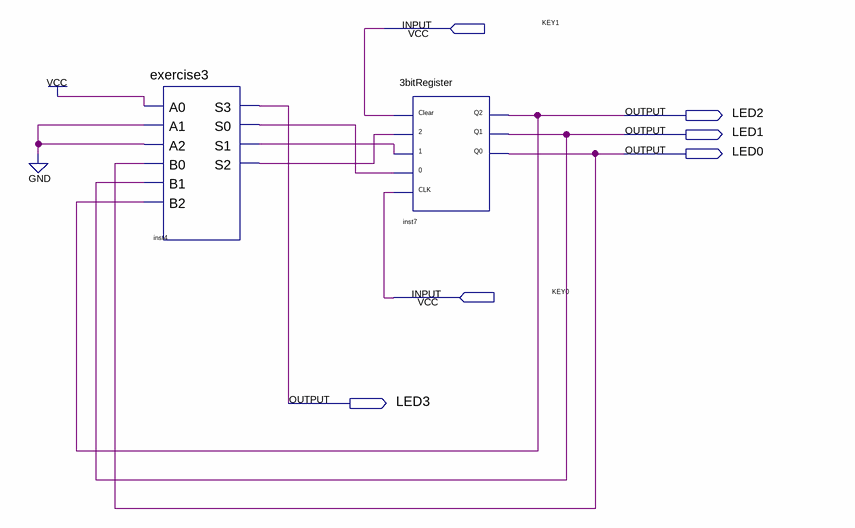
[diagram p0: schematic sheet]
// Quartus schematic exercise4.bdf as structural Verilog: 2 symbols, 6 pins
module exercise4 (
  input  KEY1,
  input  KEY0,
  output LED2,
  output LED1,
  output LED0,
  output LED3
);

  wire inst4_s0, inst4_s1, inst4_s2;

  exercise3 inst4 (
    .A0(1'b1), .A1(1'b0), .A2(1'b0), .B0(LED0), .B1(LED1), .B2(LED2), .S3(LED3), .S0(inst4_s0),
    .S1(inst4_s1), .S2(inst4_s2));
  \3bitRegister  inst7 (
    .Clear(KEY1), .\2 (inst4_s2), .\1 (inst4_s1), .\0 (inst4_s0), .CLK(KEY0), .Q2(LED2), .Q1(LED1), .Q0(LED0));
endmodule
